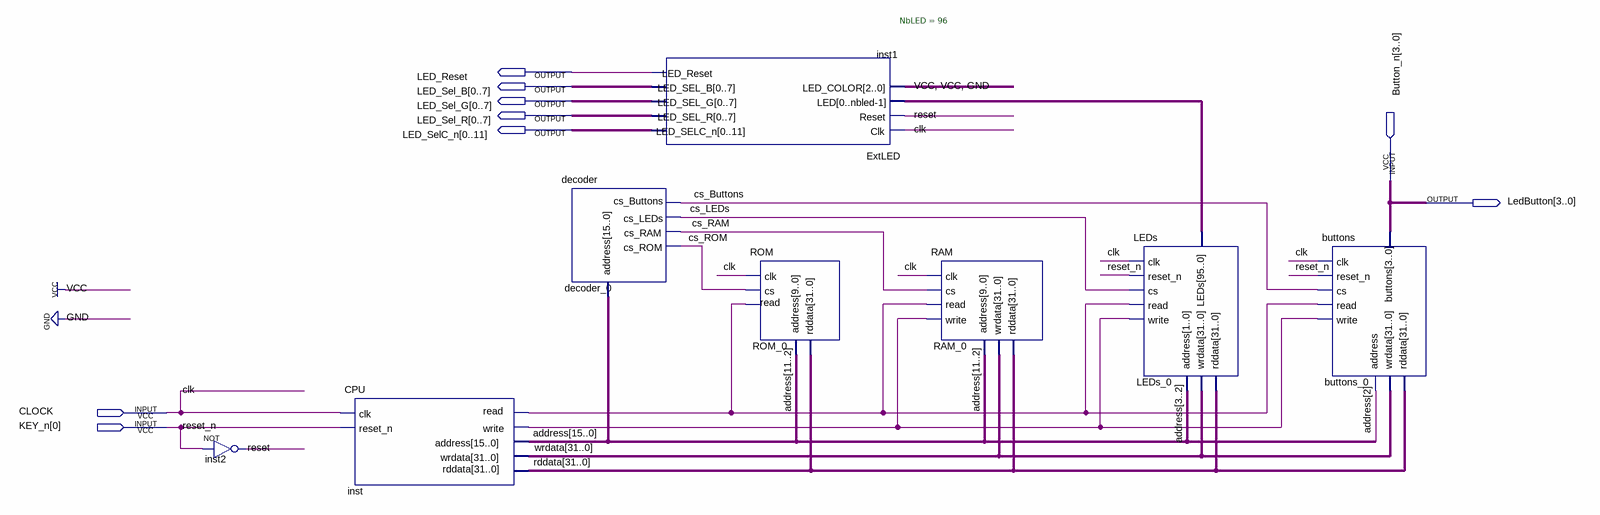
[diagram p0: schematic sheet]
// Quartus schematic System.bdf as structural Verilog: 8 symbols, 9 pins
module System (
  input  [3:0] Button_n,
  input  CLOCK,
  input  [0:0] KEY_n,
  output LED_Reset,
  output [0:7] LED_Sel_B,
  output [0:7] LED_Sel_G,
  output [0:7] LED_Sel_R,
  output [0:11] LED_SelC_n,
  output [3:0] LedButton
);

  wire cs_Buttons, cs_LEDs, cs_RAM, cs_ROM, inst_read, inst_write, reset;
  wire [15:0] address;
  wire [31:0] rddata, wrdata;
  wire [95:0] LEDs_0_leds;

  not inst2 (reset, KEY_n[0]);
  CPU inst (
    .clk(CLOCK), .reset_n(KEY_n[0]), .rddata(rddata), .write(inst_write), .wrdata(wrdata), .address(address),
    .read(inst_read));
  decoder decoder_0 (.address(address), .cs_RAM(cs_RAM), .cs_ROM(cs_ROM), .cs_Buttons(cs_Buttons), .cs_LEDs(cs_LEDs));
  ExtLED #(.NbLED(96)) inst1 (
    .Clk(CLOCK), .Reset(reset), .LED(LEDs_0_leds), .LED_COLOR(3'b110), .LED_SELC_n(LED_SelC_n),
    .LED_SEL_R(LED_Sel_R), .LED_SEL_G(LED_Sel_G), .LED_SEL_B(LED_Sel_B), .LED_Reset(LED_Reset));
  ROM ROM_0 (.clk(CLOCK), .cs(cs_ROM), .read(inst_read), .address(address[11:2]), .rddata(rddata));
  RAM RAM_0 (
    .clk(CLOCK), .cs(cs_RAM), .write(inst_write), .wrdata(wrdata), .read(inst_read), .address(address[11:2]),
    .rddata(rddata));
  LEDs LEDs_0 (
    .clk(CLOCK), .reset_n(KEY_n[0]), .cs(cs_LEDs), .write(inst_write), .address(address[3:2]),
    .wrdata(wrdata), .read(inst_read), .rddata(rddata), .LEDs(LEDs_0_leds));
  buttons buttons_0 (
    .clk(CLOCK), .reset_n(KEY_n[0]), .cs(cs_Buttons), .read(inst_read), .write(inst_write),
    .address(address[2]), .wrdata(wrdata), .buttons(Button_n), .rddata(rddata));

  assign LedButton = Button_n;

  // Other names for the same wires on the sheet: clk = CLOCK; reset_n = KEY_n[0]
endmodule
